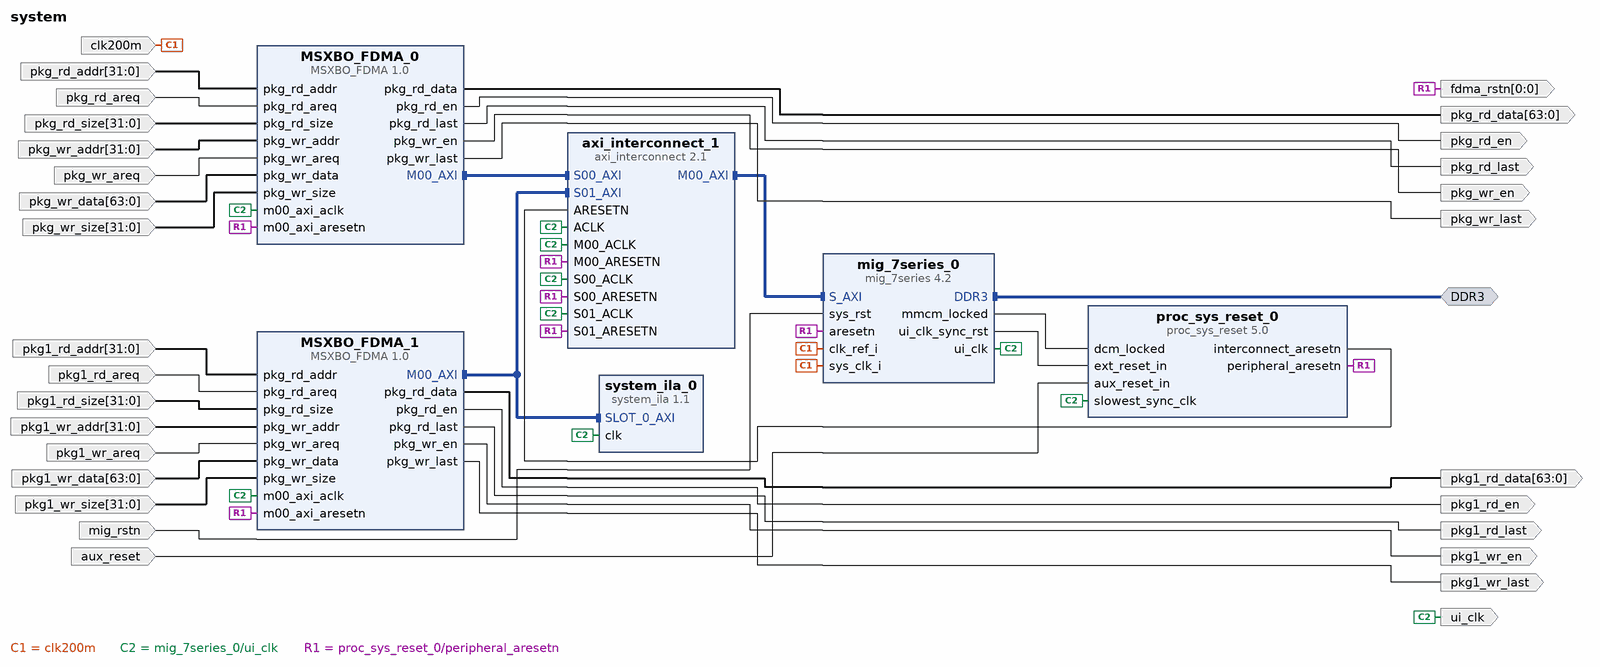
[diagram p0: block diagram of the top level]
# Vivado block design system, xc7k325tffg676-2, Vivado 2021.1
create_bd_design system

create_bd_intf_port -mode Master -vlnv xilinx.com:interface:ddrx_rtl:1.0 DDR3
create_bd_port -dir O -from 0 -to 0 fdma_rstn
create_bd_port -dir O -type clk ui_clk
create_bd_port -dir I clk200m
create_bd_port -dir I pkg_wr_areq
create_bd_port -dir I -from 31 -to 0 pkg_wr_addr
create_bd_port -dir I -from 31 -to 0 pkg_wr_size
create_bd_port -dir O pkg_wr_last
create_bd_port -dir O pkg_wr_en
create_bd_port -dir I pkg_rd_areq
create_bd_port -dir I -from 31 -to 0 pkg_rd_addr
create_bd_port -dir I -from 31 -to 0 pkg_rd_size
create_bd_port -dir O pkg_rd_last
create_bd_port -dir O pkg_rd_en
create_bd_port -dir I aux_reset
create_bd_port -dir I mig_rstn
create_bd_port -dir I pkg1_wr_areq
create_bd_port -dir I -from 31 -to 0 pkg1_wr_addr
create_bd_port -dir I -from 31 -to 0 pkg1_wr_size
create_bd_port -dir I pkg1_rd_areq
create_bd_port -dir I -from 31 -to 0 pkg1_rd_addr
create_bd_port -dir I -from 31 -to 0 pkg1_rd_size
create_bd_port -dir O pkg1_wr_last
create_bd_port -dir O pkg1_wr_en
create_bd_port -dir O pkg1_rd_last
create_bd_port -dir O pkg1_rd_en
create_bd_port -dir I -from 63 -to 0 pkg_wr_data
create_bd_port -dir I -from 63 -to 0 pkg1_wr_data
create_bd_port -dir O -from 63 -to 0 pkg_rd_data
create_bd_port -dir O -from 63 -to 0 pkg1_rd_data

create_bd_cell -type ip -vlnv xilinx.com:user:MSXBO_FDMA:1.0 MSXBO_FDMA_0
set_property -dict {CONFIG.C_M00_AXI_BURST_LEN 128 CONFIG.C_M00_AXI_DATA_WIDTH 64} [get_bd_cells MSXBO_FDMA_0]
create_bd_cell -type ip -vlnv xilinx.com:user:MSXBO_FDMA:1.0 MSXBO_FDMA_1
set_property -dict {CONFIG.C_M00_AXI_BURST_LEN 128 CONFIG.C_M00_AXI_DATA_WIDTH 64} [get_bd_cells MSXBO_FDMA_1]
create_bd_cell -type ip -vlnv xilinx.com:ip:proc_sys_reset:5.0 proc_sys_reset_0
set_property -dict {CONFIG.C_AUX_RESET_HIGH 1 CONFIG.C_AUX_RST_WIDTH 16 CONFIG.C_EXT_RST_WIDTH 16} [get_bd_cells proc_sys_reset_0]
create_bd_cell -type ip -vlnv xilinx.com:ip:mig_7series:4.2 mig_7series_0
set_property -dict [list \
  CONFIG.BOARD_MIG_PARAM Custom \
  CONFIG.RESET_BOARD_INTERFACE Custom \
  CONFIG.XML_INPUT_FILE mig_a.prj \
] [get_bd_cells mig_7series_0]
create_bd_cell -type ip -vlnv xilinx.com:ip:axi_interconnect:2.1 axi_interconnect_1
set_property -dict [list \
  CONFIG.ENABLE_ADVANCED_OPTIONS 1 \
  CONFIG.M00_HAS_DATA_FIFO 1 \
  CONFIG.M00_HAS_REGSLICE 1 \
  CONFIG.M00_SECURE 0 \
  CONFIG.NUM_MI 1 \
  CONFIG.NUM_SI 2 \
  CONFIG.S00_HAS_DATA_FIFO 2 \
  CONFIG.S00_HAS_REGSLICE 1 \
  CONFIG.S01_HAS_DATA_FIFO 2 \
  CONFIG.S01_HAS_REGSLICE 1 \
  CONFIG.STRATEGY 2 \
  CONFIG.SYNCHRONIZATION_STAGES 3 \
  CONFIG.XBAR_DATA_WIDTH 64 \
] [get_bd_cells axi_interconnect_1]
create_bd_cell -type ip -vlnv xilinx.com:ip:system_ila:1.1 system_ila_0
set_property -dict {CONFIG.C_MON_TYPE INTERFACE} [get_bd_cells system_ila_0]

# ---- connections ----

connect_bd_intf_net [get_bd_intf_pins MSXBO_FDMA_0/M00_AXI] [get_bd_intf_pins axi_interconnect_1/S00_AXI]
connect_bd_intf_net [get_bd_intf_pins MSXBO_FDMA_1/M00_AXI] [get_bd_intf_pins axi_interconnect_1/S01_AXI]
connect_bd_intf_net [get_bd_intf_pins MSXBO_FDMA_1/M00_AXI] [get_bd_intf_pins system_ila_0/SLOT_0_AXI]
connect_bd_intf_net [get_bd_intf_pins mig_7series_0/S_AXI] [get_bd_intf_pins axi_interconnect_1/M00_AXI]
connect_bd_intf_net [get_bd_intf_ports DDR3] [get_bd_intf_pins mig_7series_0/DDR3]
connect_bd_net [get_bd_pins MSXBO_FDMA_0/pkg_rd_data] [get_bd_ports pkg_rd_data]
connect_bd_net [get_bd_pins MSXBO_FDMA_0/pkg_rd_en] [get_bd_ports pkg_rd_en]
connect_bd_net [get_bd_pins MSXBO_FDMA_0/pkg_rd_last] [get_bd_ports pkg_rd_last]
connect_bd_net [get_bd_pins MSXBO_FDMA_0/pkg_wr_en] [get_bd_ports pkg_wr_en]
connect_bd_net [get_bd_pins MSXBO_FDMA_0/pkg_wr_last] [get_bd_ports pkg_wr_last]
connect_bd_net [get_bd_pins MSXBO_FDMA_1/pkg_rd_data] [get_bd_ports pkg1_rd_data]
connect_bd_net [get_bd_pins MSXBO_FDMA_1/pkg_rd_en] [get_bd_ports pkg1_rd_en]
connect_bd_net [get_bd_pins MSXBO_FDMA_1/pkg_rd_last] [get_bd_ports pkg1_rd_last]
connect_bd_net [get_bd_pins MSXBO_FDMA_1/pkg_wr_en] [get_bd_ports pkg1_wr_en]
connect_bd_net [get_bd_pins MSXBO_FDMA_1/pkg_wr_last] [get_bd_ports pkg1_wr_last]
connect_bd_net [get_bd_ports aux_reset] [get_bd_pins proc_sys_reset_0/aux_reset_in]
connect_bd_net [get_bd_ports clk200m] [get_bd_pins mig_7series_0/sys_clk_i] [get_bd_pins mig_7series_0/clk_ref_i]
connect_bd_net [get_bd_pins mig_7series_0/mmcm_locked] [get_bd_pins proc_sys_reset_0/dcm_locked]
connect_bd_net [get_bd_pins mig_7series_0/ui_clk] \
  [get_bd_ports ui_clk] [get_bd_pins MSXBO_FDMA_0/m00_axi_aclk] [get_bd_pins MSXBO_FDMA_1/m00_axi_aclk] \
  [get_bd_pins proc_sys_reset_0/slowest_sync_clk] [get_bd_pins axi_interconnect_1/ACLK] \
  [get_bd_pins axi_interconnect_1/S00_ACLK] [get_bd_pins axi_interconnect_1/S01_ACLK] \
  [get_bd_pins axi_interconnect_1/M00_ACLK] [get_bd_pins system_ila_0/clk]
connect_bd_net [get_bd_pins mig_7series_0/ui_clk_sync_rst] [get_bd_pins proc_sys_reset_0/ext_reset_in]
connect_bd_net [get_bd_ports mig_rstn] [get_bd_pins mig_7series_0/sys_rst]
connect_bd_net [get_bd_ports pkg1_rd_addr] [get_bd_pins MSXBO_FDMA_1/pkg_rd_addr]
connect_bd_net [get_bd_ports pkg1_rd_areq] [get_bd_pins MSXBO_FDMA_1/pkg_rd_areq]
connect_bd_net [get_bd_ports pkg1_rd_size] [get_bd_pins MSXBO_FDMA_1/pkg_rd_size]
connect_bd_net [get_bd_ports pkg1_wr_addr] [get_bd_pins MSXBO_FDMA_1/pkg_wr_addr]
connect_bd_net [get_bd_ports pkg1_wr_areq] [get_bd_pins MSXBO_FDMA_1/pkg_wr_areq]
connect_bd_net [get_bd_ports pkg1_wr_data] [get_bd_pins MSXBO_FDMA_1/pkg_wr_data]
connect_bd_net [get_bd_ports pkg1_wr_size] [get_bd_pins MSXBO_FDMA_1/pkg_wr_size]
connect_bd_net [get_bd_ports pkg_rd_addr] [get_bd_pins MSXBO_FDMA_0/pkg_rd_addr]
connect_bd_net [get_bd_ports pkg_rd_areq] [get_bd_pins MSXBO_FDMA_0/pkg_rd_areq]
connect_bd_net [get_bd_ports pkg_rd_size] [get_bd_pins MSXBO_FDMA_0/pkg_rd_size]
connect_bd_net [get_bd_ports pkg_wr_addr] [get_bd_pins MSXBO_FDMA_0/pkg_wr_addr]
connect_bd_net [get_bd_ports pkg_wr_areq] [get_bd_pins MSXBO_FDMA_0/pkg_wr_areq]
connect_bd_net [get_bd_ports pkg_wr_data] [get_bd_pins MSXBO_FDMA_0/pkg_wr_data]
connect_bd_net [get_bd_ports pkg_wr_size] [get_bd_pins MSXBO_FDMA_0/pkg_wr_size]
connect_bd_net [get_bd_pins proc_sys_reset_0/interconnect_aresetn] [get_bd_pins axi_interconnect_1/ARESETN]
connect_bd_net -net rst_mig_7series_0_100M_peripheral_aresetn1 [get_bd_pins proc_sys_reset_0/peripheral_aresetn] \
  [get_bd_ports fdma_rstn] [get_bd_pins MSXBO_FDMA_0/m00_axi_aresetn] [get_bd_pins MSXBO_FDMA_1/m00_axi_aresetn] \
  [get_bd_pins mig_7series_0/aresetn] [get_bd_pins axi_interconnect_1/S00_ARESETN] \
  [get_bd_pins axi_interconnect_1/S01_ARESETN] [get_bd_pins axi_interconnect_1/M00_ARESETN]

# ---- address map ----
assign_bd_address -offset 0x00000000 -range 2G -target_address_space [get_bd_addr_spaces MSXBO_FDMA_0/M00_AXI] [get_bd_addr_segs mig_7series_0/memmap/memaddr]
assign_bd_address -offset 0x00000000 -range 2G -target_address_space [get_bd_addr_spaces MSXBO_FDMA_1/M00_AXI] [get_bd_addr_segs mig_7series_0/memmap/memaddr]

validate_bd_design
save_bd_design
